# Altium project CORE_BOARD..PrjPcb
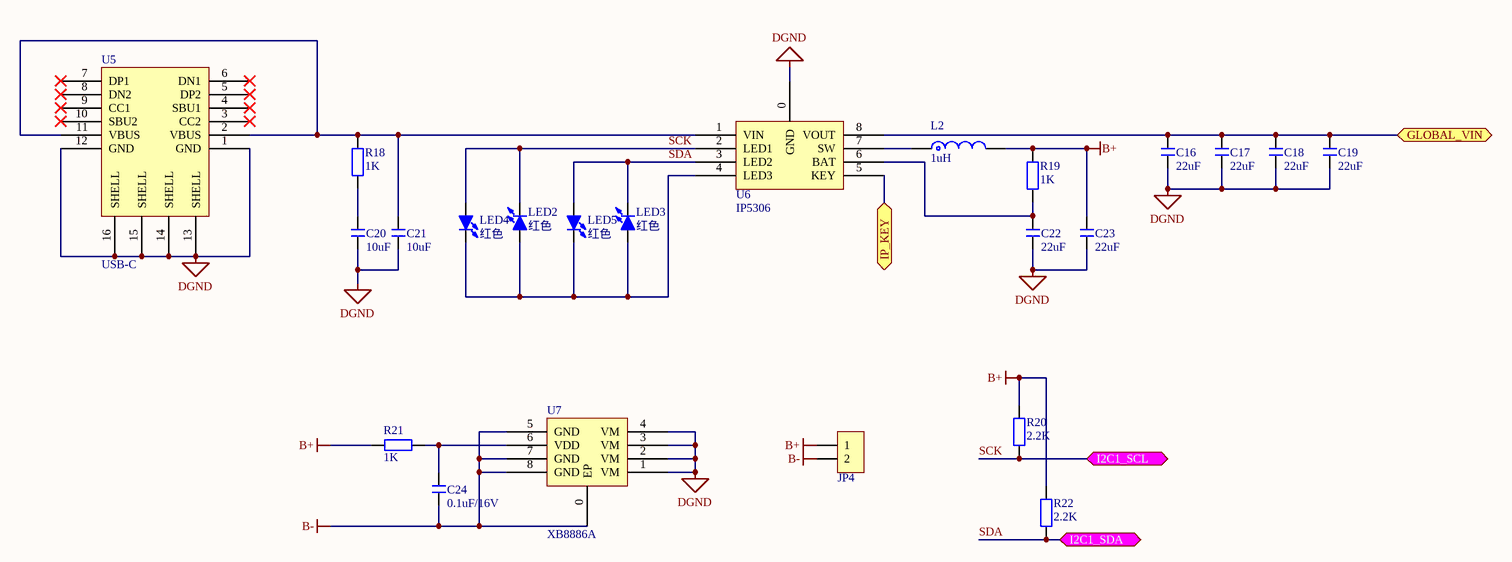
[diagram p0: POWER_BANK_PART.SchDoc]
1 sheet, 23 parts. Net scope: flat (ports and power ports of the same name join across sheets).
Board file: CORE_BOARD.PcbDoc

## Sheet POWER_BANK_PART.SchDoc
size A4; SheetNumber: 2; SheetTotal: 2

### Parts
C16  22uF  [C 0603_L]
C17  22uF  [C 0603_L]
C18  22uF  [C 0603_L]
C19  22uF  [C 0603_L]
C20  10uF  [C 0603_L]
C21  10uF  [C 0603_L]
C22  22uF  [C 0603_L]
C23  22uF  [C 0603_L]
C24  0.1uF/16V  [C 0603_L]
JP4  HDR-1X2  [KF301-5.0-2P]  (value not drawn)
L2  1uH  [CD43]
LED2  红色  [LED 0603W]
LED3  红色  [LED 0603W]
LED4  红色  [LED 0603W]
LED5  红色  [LED 0603W]
R18  1K  [R 0603_L]
R19  1K  [R 0603_L]
R20  2.2K  [R 0603_L]
R21  1K  [R 0603_L]
R22  2.2K  [R 0603_L]
U5  USB-C  [USB-C-16]
U6  IP5306  [SOP-8-G]
U7  XB8886A  [SOP-8-G]

### Ports
GLOBAL_VIN (bidir), I2C1_SCL (bidir), I2C1_SDA (bidir), IP_KEY (bidir)

### Nets
B+: C23.1 JP4.1 L2.2 R19.2 R20.2 R21.1 R22.2
B-: C24.2 JP4.2 U7.0(EP) U7.5(GND) U7.7(GND) U7.8(GND)
DGND: C16.2 C17.2 C18.2 C19.2 C20.2 C21.2 C22.2 C23.2 U5.1(GND) U5.12(GND) U5.13(SHELL) U5.14(SHELL) U5.15(SHELL) U5.16(SHELL) U6.0(GND) U7.1(VM) U7.2(VM) U7.3(VM) U7.4(VM)
SCK: LED2.2(K) LED4.1(A) R20.1 U6.2(LED1) ; port I2C1_SCL
SDA: LED3.2(K) LED5.1(A) R22.1 U6.3(LED2) ; port I2C1_SDA
NetC16_1: C16.1 C17.1 C18.1 C19.1 U6.8(VOUT) ; port GLOBAL_VIN
NetC20_1: C20.1 R18.1
NetC21_1: C21.1 R18.2 U5.2(VBUS) U5.11(VBUS) U6.1(VIN)
NetC22_1: C22.1 R19.1 U6.6(BAT)
NetC24_1: C24.1 R21.2 U7.6(VDD)
NetL2_1: L2.1 U6.7(SW)
NetLED2_1: LED2.1(A) LED3.1(A) LED4.2(K) LED5.2(K) U6.4(LED3)
NetU6_5: U6.5(KEY) ; port IP_KEY

Not connected (* = marked no-connect by the designer): U5 3(CC2)* 4(SBU1)* 5(DP2)* 6(DN1)* 7(DP1)* 8(DN2)* 9(CC1)* 10(SBU2)*

### Library data of the parts
C16-C24 = C: 无极性贴片电容; 版权归属: 源创客; BOM名称: 无极性贴片电容; 学习资源: www.ooocke.com
JP4 = Header 2: 2P接插件; 版权归属: 源创客; BOM名称: 2P接插件; 学习资源: www.ooocke.com
L2 = L-CD: 贴片功率电感; BOM名称: 功率电感; 版权归属: 源创客; 学习资源: www.ooocke.com
LED2-LED5 = LED-SMD: 贴片LED; 版权归属: 源创客; BOM名称: 贴片LED; 学习资源: www.ooocke.com
R18-R22 = R: 贴片电阻; 版权归属: 源创客; BOM名称: 贴片电阻; 学习资源: www.ooocke.com
U5 = USB-C-16P: USB-C型母接口; 版权归属: 源创客; BOM名称: USB-C型母接口; 学习资源: www.ooocke.com
U6 = IP5306: 电源芯片
U7 = XB8886A: 锂电池保护芯片